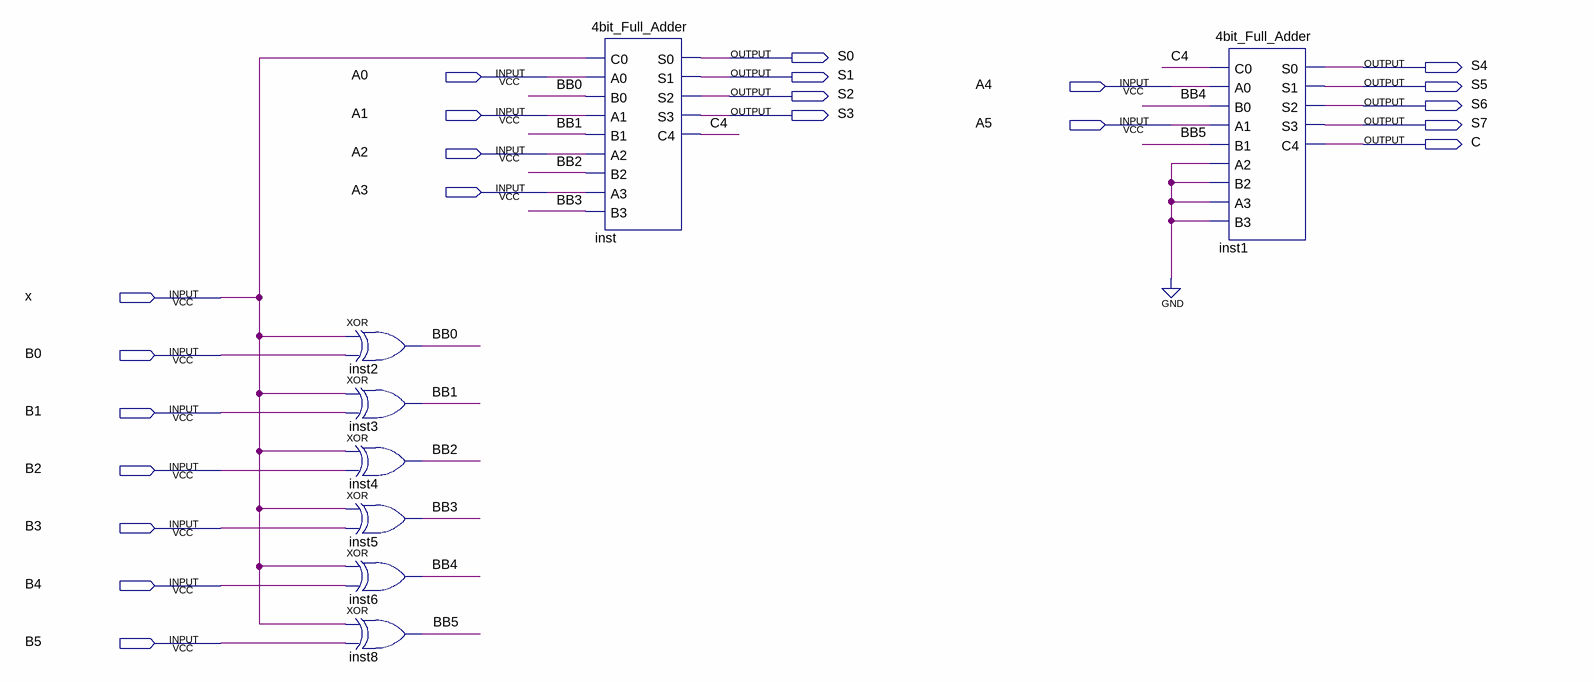
[diagram p0: schematic sheet]
// Quartus schematic FPGA_6bit_AS.bdf as structural Verilog: 8 symbols, 22 pins
module FPGA_6bit_AS (
  input  A0,
  input  A4,
  input  A1,
  input  A5,
  input  A2,
  input  A3,
  input  x,
  input  B0,
  input  B1,
  input  B2,
  input  B3,
  input  B4,
  input  B5,
  output S0,
  output S4,
  output S1,
  output S5,
  output S2,
  output S6,
  output S3,
  output S7,
  output C
);

  wire BB0, BB1, BB2, BB3, BB4, BB5, C4;

  xor inst2 (BB0, x, B0);
  xor inst3 (BB1, x, B1);
  xor inst4 (BB2, x, B2);
  xor inst5 (BB3, x, B3);
  xor inst6 (BB4, x, B4);
  xor inst8 (BB5, x, B5);
  \4bit_Full_Adder  inst (
    .C0(x), .A0(A0), .B0(BB0), .A1(A1), .B1(BB1), .A2(A2), .B2(BB2), .A3(A3), .B3(BB3), .S0(S0), .S1(S1),
    .S2(S2), .S3(S3), .C4(C4));
  \4bit_Full_Adder  inst1 (
    .C0(C4), .A0(A4), .B0(BB4), .A1(A5), .B1(BB5), .A2(1'b0), .B2(1'b0), .A3(1'b0), .B3(1'b0), .S0(S4),
    .S1(S5), .S2(S6), .S3(S7), .C4(C));
endmodule
